# EAGLE schematic FPGA_S7 (EAGLE 9.6.2)

## Sheet 1 of 3: Interface
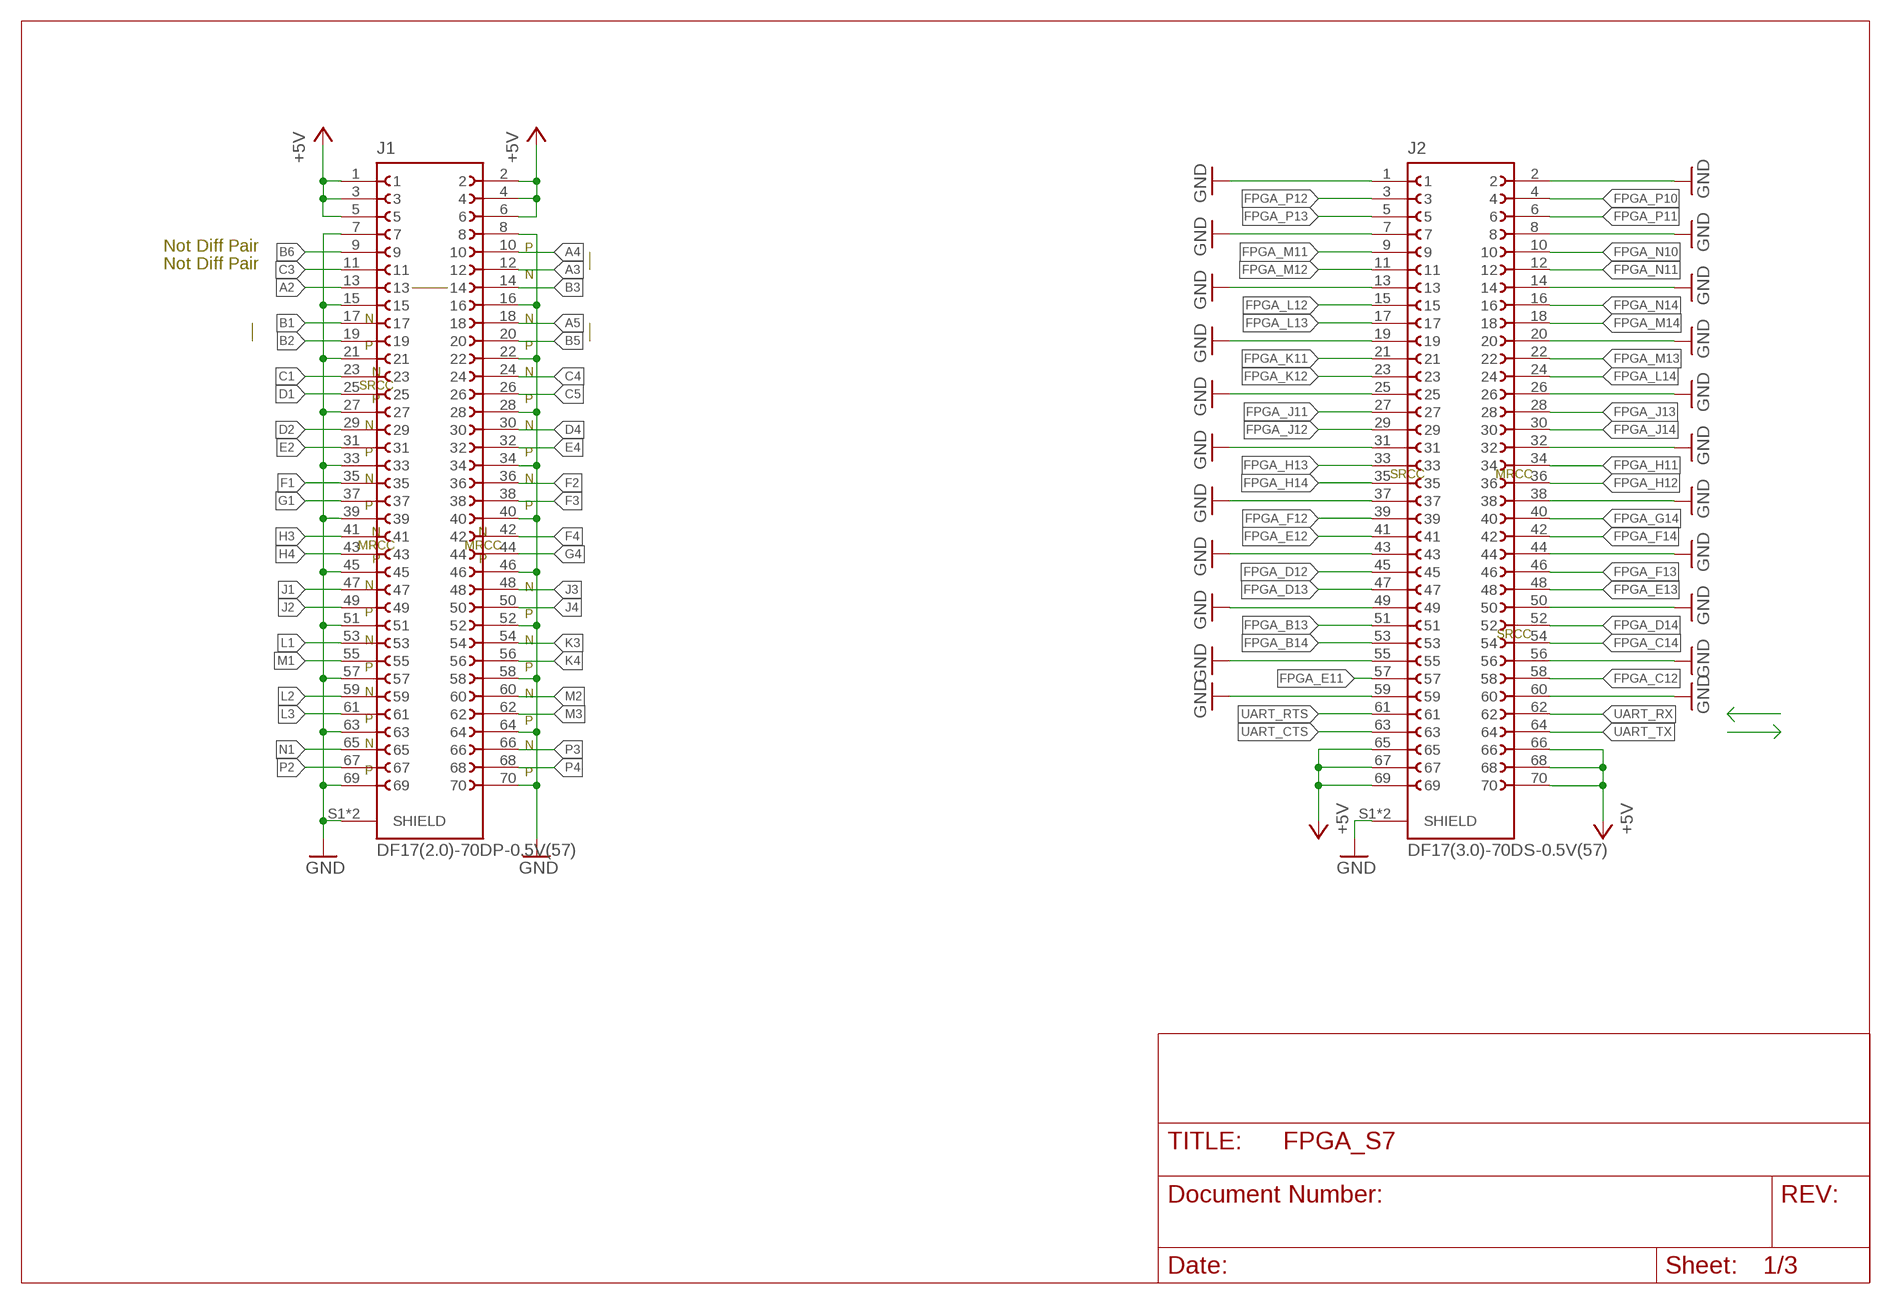
[diagram p0: schematic, sheet 1]

### Parts
J1  DF17(2.0)-70DP-0.5V(57)  [DF17(2.0)-70DP-0.5V(57)]
J2  DF17(3.0)-70DS-0.5V(57)  [DF17(3.0)-70DS-0.5V(57)]

### Nets
+5V: J1.1 J1.2 J1.3 J1.4 J1.5 J1.6 J2.65 J2.66 J2.67 J2.68 J2.69 J2.70 ; also sheet 3
A2 [data]: J1.13 ; also sheet 2
A3 [data]: J1.12 ; also sheet 2
A4 [data]: J1.10 ; also sheet 2
A5 [data]: J1.18 ; also sheet 2
B1 [data]: J1.17 ; also sheet 2
B2 [data]: J1.19 ; also sheet 2
B3 [data]: J1.14 ; also sheet 2
B5 [data]: J1.20 ; also sheet 2
B6 [data]: J1.9 ; also sheet 2
C1 [data]: J1.23 ; also sheet 2
C3 [data]: J1.11 ; also sheet 2
C4 [data]: J1.24 ; also sheet 2
C5 [data]: J1.26 ; also sheet 2
D1 [data]: J1.25 ; also sheet 2
D2 [data]: J1.29 ; also sheet 2
D4 [data]: J1.30 ; also sheet 2
E2 [data]: J1.31 ; also sheet 2
E4 [data]: J1.32 ; also sheet 2
F1 [data]: J1.35 ; also sheet 2
F2 [data]: J1.36 ; also sheet 2
F3 [data]: J1.38 ; also sheet 2
F4 [data]: J1.42 ; also sheet 2
FPGA_B13 [data]: J2.51 ; also sheet 2
FPGA_B14 [data]: J2.53 ; also sheet 2
FPGA_C12 [data]: J2.58 ; also sheet 2
FPGA_C14 [data]: J2.54 ; also sheet 2
FPGA_D12 [data]: J2.45 ; also sheet 2
FPGA_D13 [data]: J2.47 ; also sheet 2
FPGA_D14 [data]: J2.52 ; also sheet 2
FPGA_E11: J2.57 ; also sheet 2
FPGA_E12 [data]: J2.41 ; also sheet 2
FPGA_E13 [data]: J2.48 ; also sheet 2
FPGA_F12 [data]: J2.39 ; also sheet 2
FPGA_F13 [data]: J2.46 ; also sheet 2
FPGA_F14 [data]: J2.42 ; also sheet 2
FPGA_G14 [data]: J2.40 ; also sheet 2
FPGA_H11 [data]: J2.34 ; also sheet 2
FPGA_H12 [data]: J2.36 ; also sheet 2
FPGA_H13 [data]: J2.33 ; also sheet 2
FPGA_H14 [data]: J2.35 ; also sheet 2
FPGA_J11 [data]: J2.27 ; also sheet 2
FPGA_J12 [data]: J2.29 ; also sheet 2
FPGA_J13 [data]: J2.28 ; also sheet 2
FPGA_J14 [data]: J2.30 ; also sheet 2
FPGA_K11 [data]: J2.21 ; also sheet 2
FPGA_K12 [data]: J2.23 ; also sheet 2
FPGA_L12 [data]: J2.15 ; also sheet 2
FPGA_L13 [data]: J2.17 ; also sheet 2
FPGA_L14 [data]: J2.24 ; also sheet 2
FPGA_M11 [data]: J2.9 ; also sheet 2
FPGA_M12 [data]: J2.11 ; also sheet 2
FPGA_M13 [data]: J2.22 ; also sheet 2
FPGA_M14 [data]: J2.18 ; also sheet 2
FPGA_N10 [data]: J2.10 ; also sheet 2
FPGA_N11 [data]: J2.12 ; also sheet 2
FPGA_N14 [data]: J2.16 ; also sheet 2
FPGA_P10 [data]: J2.4 ; also sheet 2
FPGA_P11 [data]: J2.6 ; also sheet 2
FPGA_P12 [data]: J2.3 ; also sheet 2
FPGA_P13 [data]: J2.5 ; also sheet 2
G1 [data]: J1.37 ; also sheet 2
G4 [data]: J1.44 ; also sheet 2
GND: J1.7 J1.8 J1.15 J1.16 J1.21 J1.22 J1.27 J1.28 J1.33 J1.34 J1.39 J1.40 J1.45 J1.46 J1.51 J1.52 J1.57 J1.58 J1.63 J1.64 J1.69 J1.70 J1.S1(SHIELD) J1.S2(SHIELD) J2.1 J2.2 J2.7 J2.8 J2.13 J2.14 J2.19 J2.20 J2.25 J2.26 J2.31 J2.32 J2.37 J2.38 J2.43 J2.44 J2.49 J2.50 J2.55 J2.56 J2.59 J2.60 J2.S1(SHIELD) J2.S2(SHIELD) ; also sheet 2,3
H3 [data]: J1.41 ; also sheet 2
H4 [data]: J1.43 ; also sheet 2
J1 [data]: J1.47 ; also sheet 2
J2 [data]: J1.49 ; also sheet 2
J3 [data]: J1.48 ; also sheet 2
J4 [data]: J1.50 ; also sheet 2
K3 [data]: J1.54 ; also sheet 2
K4 [data]: J1.56 ; also sheet 2
L1 [data]: J1.53 ; also sheet 2
L2 [data]: J1.59 ; also sheet 2
L3 [data]: J1.61 ; also sheet 2
M1 [data]: J1.55 ; also sheet 2
M2 [data]: J1.60 ; also sheet 2
M3 [data]: J1.62 ; also sheet 2
N1 [data]: J1.65 ; also sheet 2
P2 [data]: J1.67 ; also sheet 2
P3 [data]: J1.66 ; also sheet 2
P4 [data]: J1.68 ; also sheet 2
UART_CTS [data]: J2.63 ; also sheet 2
UART_RTS [data]: J2.61 ; also sheet 2
UART_RX [data]: J2.62 ; also sheet 2
UART_TX [data]: J2.64 ; also sheet 2

### Notes on the sheet
- Not Diff Pair
- P
   
  N
- Not Diff Pair
- N
   
  P
- N
   
  P
- N
  SRCC
  P
- N
   
  P
- N
   
  P
- N
   
  P
- SRCC | MRCC
- N
   
  P
- N
   
  P
- N
  MRCC
  P
- N
  MRCC
  P
- N
   
  P
- N
   
  P
- SRCC
- N
   
  P
- N
   
  P
- N
   
  P
- N
   
  P
- N
   
  P
- N
   
  P

## Sheet 2 of 3: FPGA
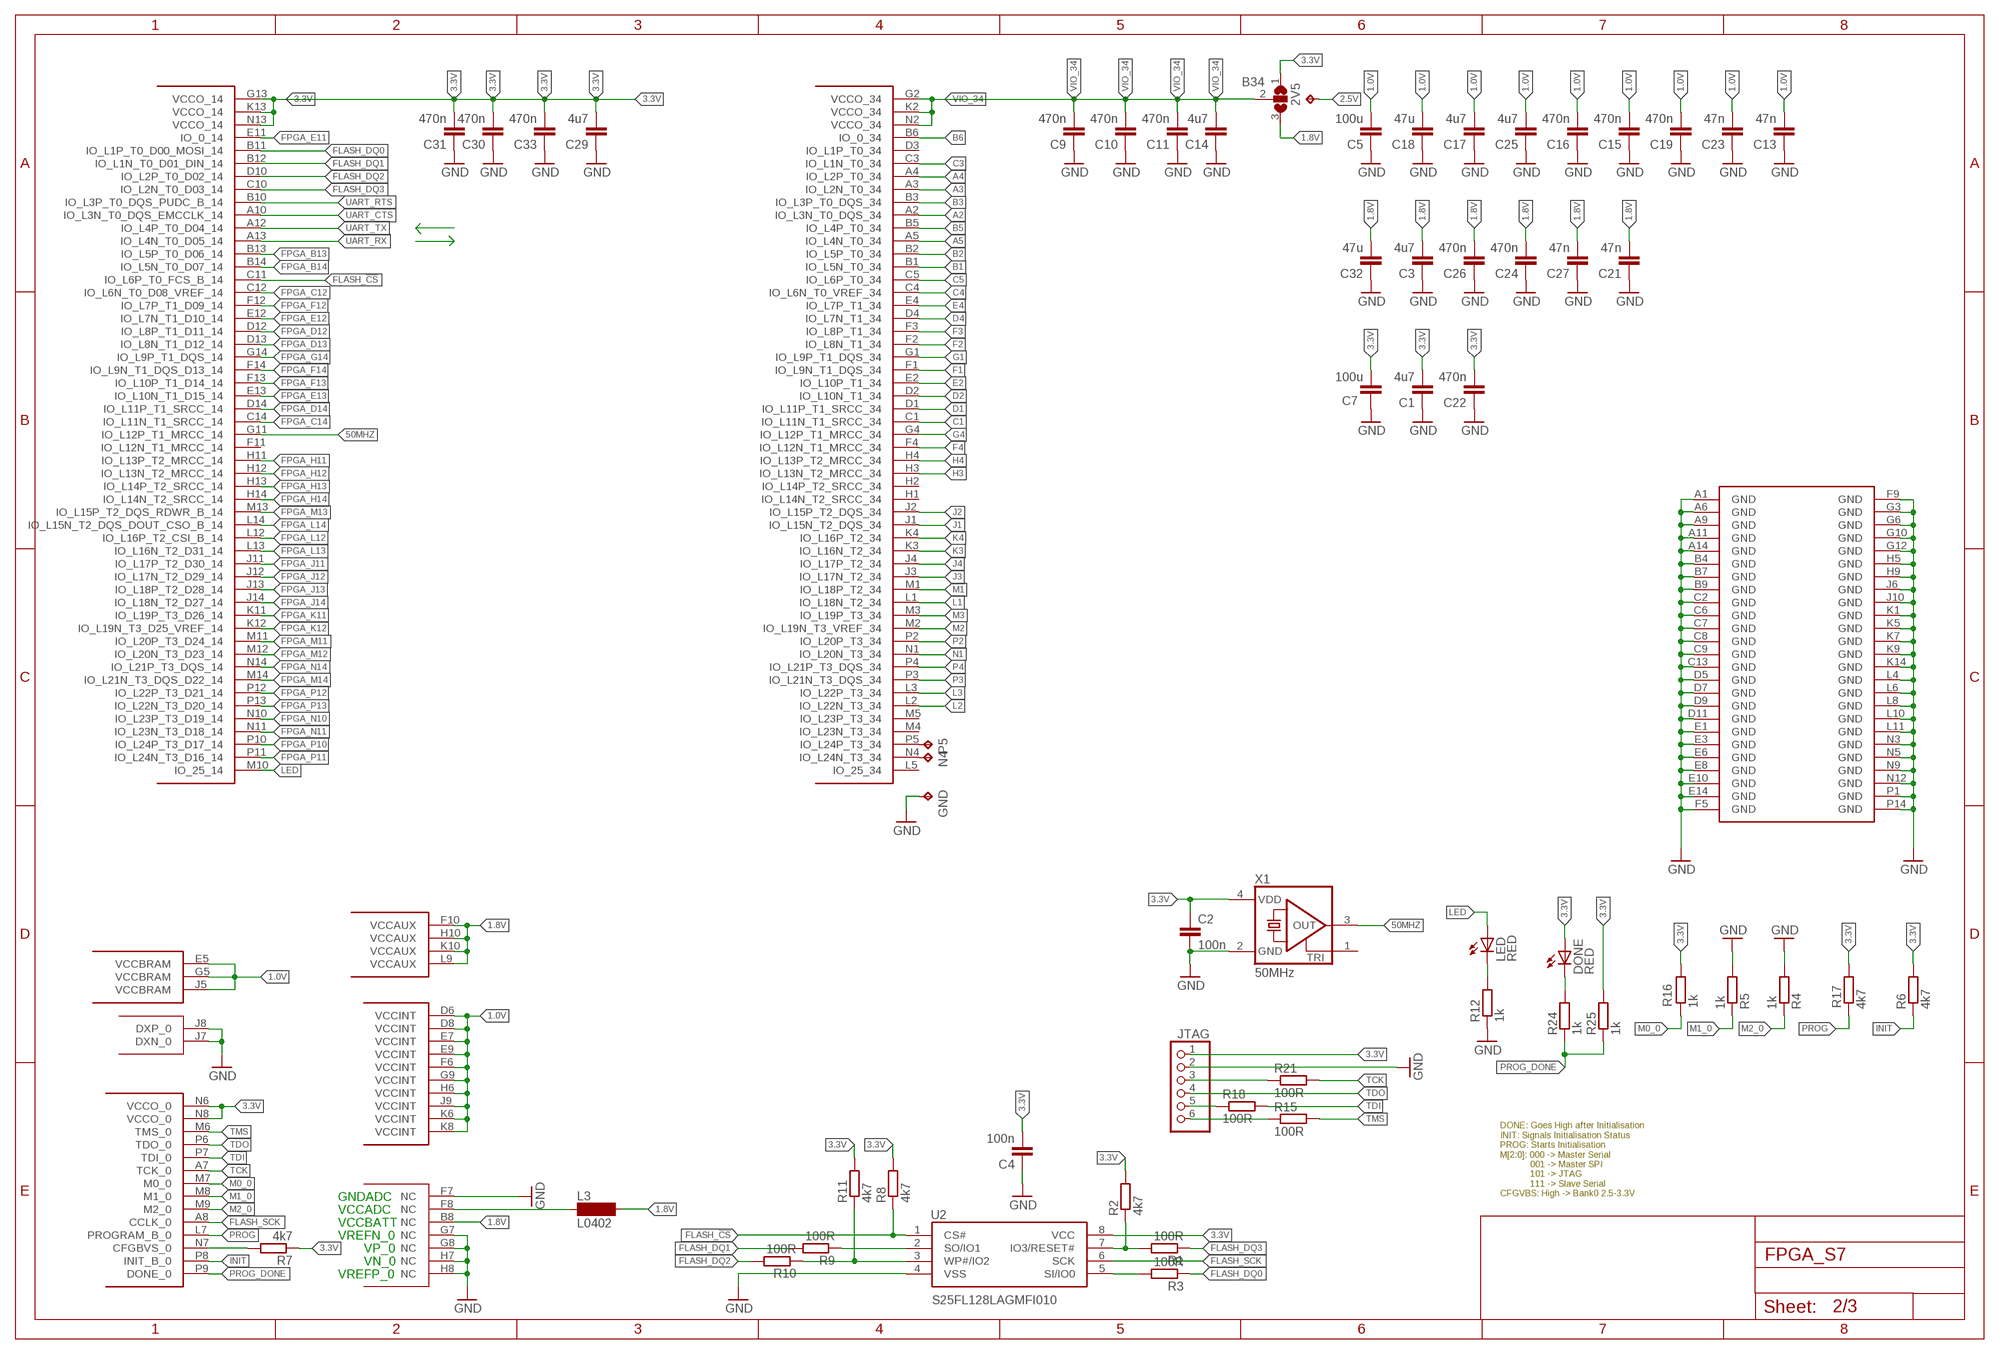
[diagram p1: schematic, sheet 2]

### Parts
2V5  TPTP12SQ  [TP12SQ]
B34  SJ2W  [SJ_2]
C1  4u7  C-EUC0603  [C0603]
C2  100n  C-EUC0402  [C0402]
C3  4u7  C-EUC0603  [C0603]
C4  100n  C-EUC0402  [C0402]
C5  100u  C-EUC1206  [C1206]
C7  100u  C-EUC1206  [C1206]
C9  470n  C-EUC0402  [C0402]
C10  470n  C-EUC0402  [C0402]
C11  470n  C-EUC0402  [C0402]
C13  47n  C-EUC0402  [C0402]
C14  4u7  C-EUC0603  [C0603]
C15  470n  C-EUC0402  [C0402]
C16  470n  C-EUC0402  [C0402]
C17  4u7  C-EUC0603  [C0603]
C18  47u  C-EUC0805  [C0805]
C19  470n  C-EUC0402  [C0402]
C21  47n  C-EUC0402  [C0402]
C22  470n  C-EUC0402  [C0402]
C23  47n  C-EUC0402  [C0402]
C24  470n  C-EUC0402  [C0402]
C25  4u7  C-EUC0603  [C0603]
C26  470n  C-EUC0402  [C0402]
C27  47n  C-EUC0402  [C0402]
C29  4u7  C-EUC0603  [C0603]
C30  470n  C-EUC0402  [C0402]
C31  470n  C-EUC0402  [C0402]
C32  47u  C-EUC0805  [C0805]
C33  470n  C-EUC0402  [C0402]
DONE  RED  LEDCHIP-LED0603  [CHIP-LED0603]
GND  TPTP15R  [TP15R]
JTAG  PINHD-1X6_2.00  [1X06M]
L3  L0402  [C0402]
LED  RED  LEDCHIP-LED0603  [CHIP-LED0603]
N4  TPTP15R  [TP15R]
P5  TPTP15R  [TP15R]
R1  100R  R-EU_R0402  [R0402]
R2  4k7  R-EU_R0402  [R0402]
R3  100R  R-EU_R0402  [R0402]
R4  1k  R-EU_R0402  [R0402]
R5  1k  R-EU_R0402  [R0402]
R6  4k7  R-EU_R0402  [R0402]
R7  4k7  R-EU_R0402  [R0402]
R8  4k7  R-EU_R0402  [R0402]
R9  100R  R-EU_R0402  [R0402]
R10  100R  R-EU_R0402  [R0402]
R11  4k7  R-EU_R0402  [R0402]
R12  1k  R-EU_R0402  [R0402]
R15  100R  R-EU_R0402  [R0402]
R16  1k  R-EU_R0402  [R0402]
R17  4k7  R-EU_R0402  [R0402]
R18  100R  R-EU_R0402  [R0402]
R21  100R  R-EU_R0402  [R0402]
R24  1k  R-EU_R0402  [R0402]
R25  1k  R-EU_R0402  [R0402]
U1  XC7S15-2FTGB196I  [BGA196C100P14X14_1500X1500X155]
U2  S25FL128LAGMFI010  [SOIC127P800X216-8N]
X1  50MHz  ASE  [ASE]

### Nets
1.0V: C5.1 C13.2 C15.2 C16.2 C17.2 C18.1 C19.2 C23.2 C25.2 U1.D6(VCCINT) U1.D8(VCCINT) U1.E5(VCCBRAM) U1.E7(VCCINT) U1.E9(VCCINT) U1.F6(VCCINT) U1.G5(VCCBRAM) U1.G9(VCCINT) U1.H6(VCCINT) U1.J5(VCCBRAM) U1.J9(VCCINT) U1.K6(VCCINT) U1.K8(VCCINT) ; also sheet 3
1.8V: B34.3 C3.2 C21.2 C24.2 C26.2 C27.2 C32.2 L3.2 U1.B8(NC) U1.F10(VCCAUX) U1.H10(VCCAUX) U1.K10(VCCAUX) U1.L9(VCCAUX) ; also sheet 3
2.5V: 2V5.TP ; also sheet 3
3.3V: B34.1 C1.2 C2.1 C4.2 C7.1 C22.2 C29.2 C30.2 C31.2 C33.2 DONE.A JTAG.1 R2.2 R6.2 R7.1 R8.2 R11.2 R16.1 R17.1 R25.2 U1.G13(VCCO_14) U1.K13(VCCO_14) U1.N6(VCCO_0) U1.N8(VCCO_0) U1.N13(VCCO_14) U2.8(VCC) X1.4(VDD) ; also sheet 3
50MHZ: U1.G11(IO_L12P_T1_MRCC_14) X1.3(OUT)
A2 [data]: U1.A2(IO_L3N_T0_DQS_34) ; also sheet 1
A3 [data]: U1.A3(IO_L2N_T0_34) ; also sheet 1
A4 [data]: U1.A4(IO_L2P_T0_34) ; also sheet 1
A5 [data]: U1.A5(IO_L4N_T0_34) ; also sheet 1
B1 [data]: U1.B1(IO_L5N_T0_34) ; also sheet 1
B2 [data]: U1.B2(IO_L5P_T0_34) ; also sheet 1
B3 [data]: U1.B3(IO_L3P_T0_DQS_34) ; also sheet 1
B5 [data]: U1.B5(IO_L4P_T0_34) ; also sheet 1
B6 [data]: U1.B6(IO_0_34) ; also sheet 1
C1 [data]: U1.C1(IO_L11N_T1_SRCC_34) ; also sheet 1
C3 [data]: U1.C3(IO_L1N_T0_34) ; also sheet 1
C4 [data]: U1.C4(IO_L6N_T0_VREF_34) ; also sheet 1
C5 [data]: U1.C5(IO_L6P_T0_34) ; also sheet 1
D1 [data]: U1.D1(IO_L11P_T1_SRCC_34) ; also sheet 1
D2 [data]: U1.D2(IO_L10N_T1_34) ; also sheet 1
D4 [data]: U1.D4(IO_L7N_T1_34) ; also sheet 1
E2 [data]: U1.E2(IO_L10P_T1_34) ; also sheet 1
E4 [data]: U1.E4(IO_L7P_T1_34) ; also sheet 1
F1 [data]: U1.F1(IO_L9N_T1_DQS_34) ; also sheet 1
F2 [data]: U1.F2(IO_L8N_T1_34) ; also sheet 1
F3 [data]: U1.F3(IO_L8P_T1_34) ; also sheet 1
F4 [data]: U1.F4(IO_L12N_T1_MRCC_34) ; also sheet 1
FLASH_!CS: R8.1 U1.C11(IO_L6P_T0_FCS_B_14) U2.1(CS#)
FLASH_DQ0: R3.1 U1.B11(IO_L1P_T0_D00_MOSI_14)
FLASH_DQ1: R9.2 U1.B12(IO_L1N_T0_D01_DIN_14)
FLASH_DQ2: R10.2 U1.D10(IO_L2P_T0_D02_14)
FLASH_DQ3: R1.1 U1.C10(IO_L2N_T0_D03_14)
FLASH_SCK: U1.A8(CCLK_0) U2.6(SCK)
FPGA_B13 [data]: U1.B13(IO_L5P_T0_D06_14) ; also sheet 1
FPGA_B14 [data]: U1.B14(IO_L5N_T0_D07_14) ; also sheet 1
FPGA_C12 [data]: U1.C12(IO_L6N_T0_D08_VREF_14) ; also sheet 1
FPGA_C14 [data]: U1.C14(IO_L11N_T1_SRCC_14) ; also sheet 1
FPGA_D12 [data]: U1.D12(IO_L8P_T1_D11_14) ; also sheet 1
FPGA_D13 [data]: U1.D13(IO_L8N_T1_D12_14) ; also sheet 1
FPGA_D14 [data]: U1.D14(IO_L11P_T1_SRCC_14) ; also sheet 1
FPGA_E11: U1.E11(IO_0_14) ; also sheet 1
FPGA_E12 [data]: U1.E12(IO_L7N_T1_D10_14) ; also sheet 1
FPGA_E13 [data]: U1.E13(IO_L10N_T1_D15_14) ; also sheet 1
FPGA_F12 [data]: U1.F12(IO_L7P_T1_D09_14) ; also sheet 1
FPGA_F13 [data]: U1.F13(IO_L10P_T1_D14_14) ; also sheet 1
FPGA_F14 [data]: U1.F14(IO_L9N_T1_DQS_D13_14) ; also sheet 1
FPGA_G14 [data]: U1.G14(IO_L9P_T1_DQS_14) ; also sheet 1
FPGA_H11 [data]: U1.H11(IO_L13P_T2_MRCC_14) ; also sheet 1
FPGA_H12 [data]: U1.H12(IO_L13N_T2_MRCC_14) ; also sheet 1
FPGA_H13 [data]: U1.H13(IO_L14P_T2_SRCC_14) ; also sheet 1
FPGA_H14 [data]: U1.H14(IO_L14N_T2_SRCC_14) ; also sheet 1
FPGA_J11 [data]: U1.J11(IO_L17P_T2_D30_14) ; also sheet 1
FPGA_J12 [data]: U1.J12(IO_L17N_T2_D29_14) ; also sheet 1
FPGA_J13 [data]: U1.J13(IO_L18P_T2_D28_14) ; also sheet 1
FPGA_J14 [data]: U1.J14(IO_L18N_T2_D27_14) ; also sheet 1
FPGA_K11 [data]: U1.K11(IO_L19P_T3_D26_14) ; also sheet 1
FPGA_K12 [data]: U1.K12(IO_L19N_T3_D25_VREF_14) ; also sheet 1
FPGA_L12 [data]: U1.L12(IO_L16P_T2_CSI_B_14) ; also sheet 1
FPGA_L13 [data]: U1.L13(IO_L16N_T2_D31_14) ; also sheet 1
FPGA_L14 [data]: U1.L14(IO_L15N_T2_DQS_DOUT_CSO_B_14) ; also sheet 1
FPGA_M11 [data]: U1.M11(IO_L20P_T3_D24_14) ; also sheet 1
FPGA_M12 [data]: U1.M12(IO_L20N_T3_D23_14) ; also sheet 1
FPGA_M13 [data]: U1.M13(IO_L15P_T2_DQS_RDWR_B_14) ; also sheet 1
FPGA_M14 [data]: U1.M14(IO_L21N_T3_DQS_D22_14) ; also sheet 1
FPGA_N10 [data]: U1.N10(IO_L23P_T3_D19_14) ; also sheet 1
FPGA_N11 [data]: U1.N11(IO_L23N_T3_D18_14) ; also sheet 1
FPGA_N14 [data]: U1.N14(IO_L21P_T3_DQS_14) ; also sheet 1
FPGA_P10 [data]: U1.P10(IO_L24P_T3_D17_14) ; also sheet 1
FPGA_P11 [data]: U1.P11(IO_L24N_T3_D16_14) ; also sheet 1
FPGA_P12 [data]: U1.P12(IO_L22P_T3_D21_14) ; also sheet 1
FPGA_P13 [data]: U1.P13(IO_L22N_T3_D20_14) ; also sheet 1
G1 [data]: U1.G1(IO_L9P_T1_DQS_34) ; also sheet 1
G4 [data]: U1.G4(IO_L12P_T1_MRCC_34) ; also sheet 1
GND: C1.1 C2.2 C3.1 C4.1 C5.2 C7.2 C9.1 C10.1 C11.1 C13.1 C14.1 C15.1 C16.1 C17.1 C18.2 C19.1 C21.1 C22.1 C23.1 C24.1 C25.1 C26.1 C27.1 C29.1 C30.1 C31.1 C32.1 C33.1 GND.TP JTAG.2 R4.2 R5.2 R12.1 U1.A1(GND) U1.A6(GND) U1.A9(GND) U1.A11(GND) U1.A14(GND) U1.B4(GND) U1.B7(GND) U1.B9(GND) U1.C2(GND) U1.C6(GND) U1.C7(GND) U1.C8(GND) U1.C9(GND) U1.C13(GND) U1.D5(GND) U1.D7(GND) U1.D9(GND) U1.D11(GND) U1.E1(GND) U1.E3(GND) U1.E6(GND) U1.E8(GND) U1.E10(GND) U1.E14(GND) U1.F5(GND) U1.F7(NC) U1.F9(GND) U1.G3(GND) U1.G6(GND) U1.G7(NC) U1.G8(NC) U1.G10(GND) U1.G12(GND) U1.H5(GND) U1.H7(NC) U1.H8(NC) U1.H9(GND) U1.J6(GND) U1.J7(DXN_0) U1.J8(DXP_0) U1.J10(GND) U1.K1(GND) U1.K5(GND) U1.K7(GND) U1.K9(GND) U1.K14(GND) U1.L4(GND) U1.L6(GND) U1.L8(GND) U1.L10(GND) U1.L11(GND) U1.N3(GND) U1.N5(GND) U1.N9(GND) U1.N12(GND) U1.P1(GND) U1.P14(GND) U2.4(VSS) X1.2(GND) ; also sheet 1,3
H3 [data]: U1.H3(IO_L13N_T2_MRCC_34) ; also sheet 1
H4 [data]: U1.H4(IO_L13P_T2_MRCC_34) ; also sheet 1
INIT: R6.1 U1.P8(INIT_B_0)
J1 [data]: U1.J1(IO_L15N_T2_DQS_34) ; also sheet 1
J2 [data]: U1.J2(IO_L15P_T2_DQS_34) ; also sheet 1
J3 [data]: U1.J3(IO_L17N_T2_34) ; also sheet 1
J4 [data]: U1.J4(IO_L17P_T2_34) ; also sheet 1
K3 [data]: U1.K3(IO_L16N_T2_34) ; also sheet 1
K4 [data]: U1.K4(IO_L16P_T2_34) ; also sheet 1
L1 [data]: U1.L1(IO_L18N_T2_34) ; also sheet 1
L2 [data]: U1.L2(IO_L22N_T3_34) ; also sheet 1
L3 [data]: U1.L3(IO_L22P_T3_34) ; also sheet 1
LED: LED.A U1.M10(IO_25_14)
M0_0: R16.2 U1.M7(M0_0)
M1 [data]: U1.M1(IO_L18P_T2_34) ; also sheet 1
M1_0: R5.1 U1.M8(M1_0)
M2 [data]: U1.M2(IO_L19N_T3_VREF_34) ; also sheet 1
M2_0: R4.1 U1.M9(M2_0)
M3 [data]: U1.M3(IO_L19P_T3_34) ; also sheet 1
N1 [data]: U1.N1(IO_L20N_T3_34) ; also sheet 1
N$00003: L3.1 U1.F8(NC)
N$00004: LED.C R12.2
N$00006: R1.2 R2.1 U2.7(IO3/RESET#)
N$00009: R7.2 U1.N7(CFGBVS_0)
N$00010: R3.2 U2.5(SI/IO0)
N$00011: R9.1 U2.2(SO/IO1)
N$00012: R10.1 R11.1 U2.3(WP#/IO2)
N$00013: P5.TP U1.P5(IO_L24P_T3_34)
N$00014: N4.TP U1.N4(IO_L24N_T3_34)
N$00019: DONE.C R24.2
N$00022: JTAG.5 R18.1
N$00027: JTAG.3 R21.1
N$00031: JTAG.6 R15.1
P2 [data]: U1.P2(IO_L20P_T3_34) ; also sheet 1
P3 [data]: U1.P3(IO_L21N_T3_DQS_34) ; also sheet 1
P4 [data]: U1.P4(IO_L21P_T3_DQS_34) ; also sheet 1
PROG: R17.2 U1.L7(PROGRAM_B_0)
PROG_DONE: R24.1 R25.1 U1.P9(DONE_0)
TCK: R21.2 U1.A7(TCK_0)
TDI: R18.2 U1.P7(TDI_0)
TDO: JTAG.4 U1.P6(TDO_0)
TMS: R15.2 U1.M6(TMS_0)
UART_CTS [data]: U1.A10(IO_L3N_T0_DQS_EMCCLK_14) ; also sheet 1
UART_RTS [data]: U1.B10(IO_L3P_T0_DQS_PUDC_B_14) ; also sheet 1
UART_RX [data]: U1.A13(IO_L4N_T0_D05_14) ; also sheet 1
UART_TX [data]: U1.A12(IO_L4P_T0_D04_14) ; also sheet 1
VIO_34: B34.2 C9.2 C10.2 C11.2 C14.2 U1.G2(VCCO_34) U1.K2(VCCO_34) U1.N2(VCCO_34)
Unconnected: U1.D3(IO_L1P_T0_34) U1.F11(IO_L12N_T1_MRCC_14) U1.H1(IO_L14N_T2_SRCC_34) U1.H2(IO_L14P_T2_SRCC_34) U1.L5(IO_25_34) U1.M4(IO_L23N_T3_34) U1.M5(IO_L23P_T3_34) X1.1(TRI)

### Notes on the sheet
- GNDADC
- DONE: Goes High after Initialisation
  INIT: Signals Initialisation Status
  PROG: Starts Initialisation
  M[2:0]: 000 -> Master Serial
              001 -> Master SPI
              101 -> JTAG
              111 -> Slave Serial
  CFGVBS: High -> Bank0 2.5-3.3V
- VCCADC
- VCCBATT
- VREFN_0
- VP_0
- VN_0
- VREFP_0

## Sheet 3 of 3: Power
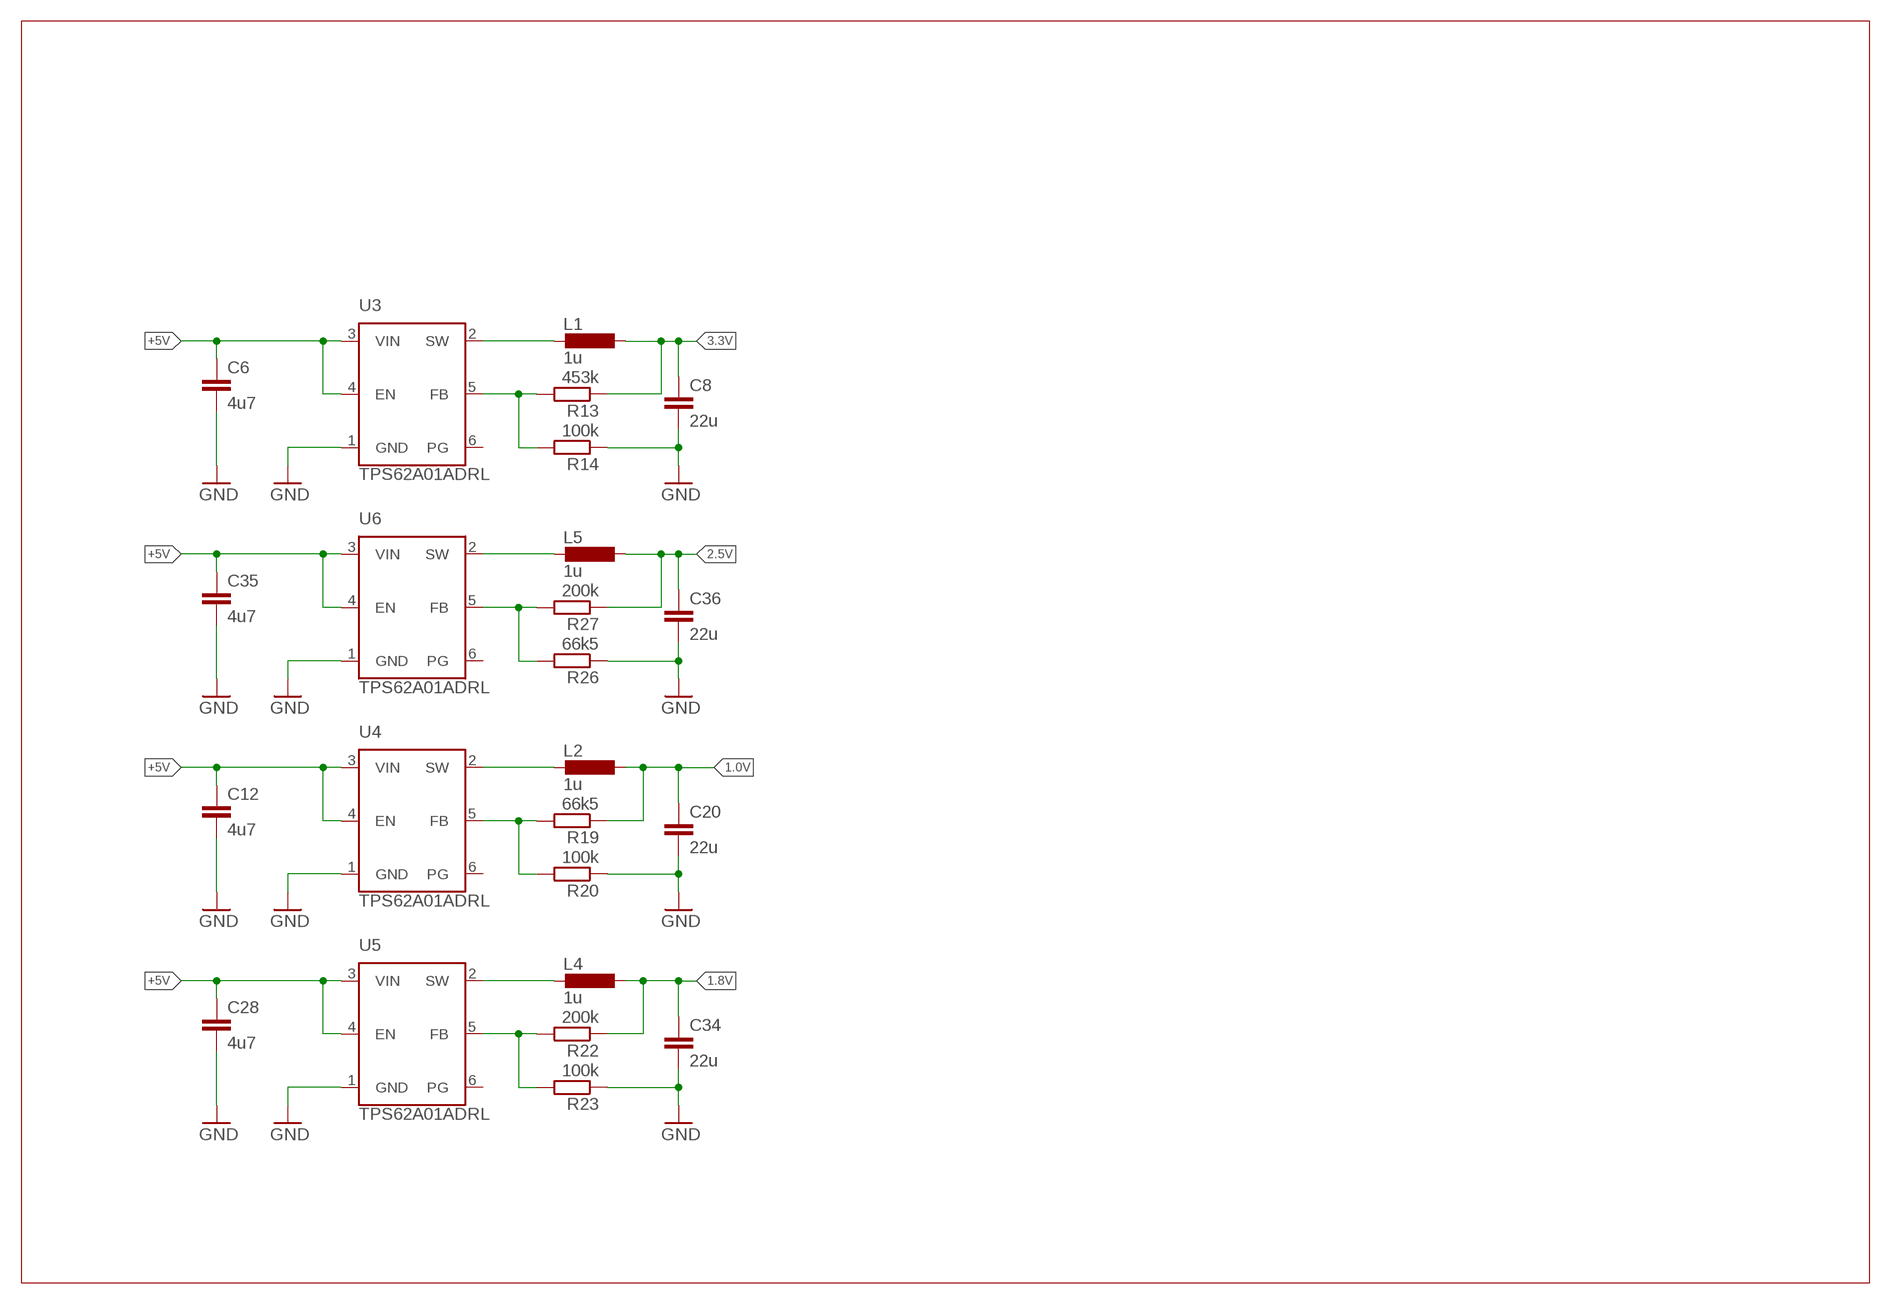
[diagram p2: schematic, sheet 3]

### Parts
C6  4u7  C-EUC0603  [C0603]
C8  22u  C-EUC0603  [C0603]
C12  4u7  C-EUC0603  [C0603]
C20  22u  C-EUC0603  [C0603]
C28  4u7  C-EUC0603  [C0603]
C34  22u  C-EUC0603  [C0603]
C35  4u7  C-EUC0603  [C0603]
C36  22u  C-EUC0603  [C0603]
L1  1u  L-EU1008  [L1008]
L2  1u  L-EU1008  [L1008]
L4  1u  L-EU1008  [L1008]
L5  1u  L-EU1008  [L1008]
R13  453k  R-EU_R0402  [R0402]
R14  100k  R-EU_R0402  [R0402]
R19  66k5  R-EU_R0402  [R0402]
R20  100k  R-EU_R0402  [R0402]
R22  200k  R-EU_R0402  [R0402]
R23  100k  R-EU_R0402  [R0402]
R26  66k5  R-EU_R0402  [R0402]
R27  200k  R-EU_R0402  [R0402]
U3  TPS62A01ADRL  [SOTFL50P160X60-6N]
U4  TPS62A01ADRL  [SOTFL50P160X60-6N]
U5  TPS62A01ADRL  [SOTFL50P160X60-6N]
U6  TPS62A01ADRL  [SOTFL50P160X60-6N]

### Nets
1.0V: C20.1 L2.1 R19.1 ; also sheet 2
1.8V: C34.1 L4.1 R22.1 ; also sheet 2
2.5V: C36.1 L5.1 R27.1 ; also sheet 2
3.3V: C8.1 L1.1 R13.1 ; also sheet 2
+5V: C6.1 C12.1 C28.1 C35.1 U3.3(VIN) U3.4(EN) U4.3(VIN) U4.4(EN) U5.3(VIN) U5.4(EN) U6.3(VIN) U6.4(EN) ; also sheet 1
GND: C6.2 C8.2 C12.2 C20.2 C28.2 C34.2 C35.2 C36.2 R14.1 R20.1 R23.1 R26.1 U3.1(GND) U4.1(GND) U5.1(GND) U6.1(GND) ; also sheet 1,2
N$00005: L2.2 U4.2(SW)
N$00020: L5.2 U6.2(SW)
N$00021: R26.2 R27.2 U6.5(FB)
N$00040: R19.2 R20.2 U4.5(FB)
N$00044: R13.2 R14.2 U3.5(FB)
N$00045: L4.2 U5.2(SW)
N$00049: R22.2 R23.2 U5.5(FB)
N$50: L1.2 U3.2(SW)
Unconnected: U3.6(PG) U4.6(PG) U5.6(PG) U6.6(PG)

## Library data of the parts
2V5 GND N4 P5 = testpad:TP: Test pad
B34 = jumper:SJ2W: SMD solder JUMPER
C1 C3 C6 C12 C14 C17 C25 C28 C29 C35 = rcl:C-EU: CAPACITOR, European symbol; LCSC: C19666
C2 C4 = rcl:C-EU: CAPACITOR, European symbol; LCSC: C1525
C5 C7 = rcl:C-EU: CAPACITOR, European symbol; DIGIKEY: 490-GRM31CD80J107MEA8LCT-ND; LCSC: C15008; SPICEPREFIX: C
C8 C20 C34 C36 = rcl:C-EU: CAPACITOR, European symbol; LCSC: C109448
C9-C11 C15 C16 C19 C22 C24 C26 C30 C31 C33 = rcl:C-EU: CAPACITOR, European symbol; LCSC: C162159
C13 C21 C23 C27 = rcl:C-EU: CAPACITOR, European symbol; LCSC: C327054
C18 = rcl:C-EU: CAPACITOR, European symbol; LCSC: C77072; SPICEPREFIX: C
C32 = rcl:C-EU: CAPACITOR, European symbol; LCSC: C77072
DONE LED = led:LED: LED OSRAM: - CHIPLED LG R971, LG N971, LY N971, LG Q971, LY Q971, LO R971, LY R971 LH N974, LH R974 LS Q976, LO Q976, LY Q976 LO Q996 - Hyper CHIPLED LW Q18S LB Q993, LB Q99A, LB R99A - SideLED LS A670, LO A670, LY A670, LG A670, LP A670 LB A673, LV A673, LT A673, LW A673 LH A674 LY A675 LS A676, LA A676, LO A676, LY A676, LW A676 LS A679, LY A679, LG A679 - Hyper Micro SIDELED® LS Y876, LA Y876, LO Y876, LY Y876 LT Y87S - SmartLED LW L88C, LW L88S LB L89C, LB L89S, LG L890 LS L89K, LO L89K, LY L89K LS L896, LA L896, LO L896, LY L896 - TOPLED LS T670, LO T670, LY T670, LG T670, LP T670 LSG T670, LSP T670, LSY T670, LOP T670, LYG T670 LG T671, LOG T671, LSG T671 LB T673, LV T673, LT T673, LW T673 LH T674 LS T676, LA T676, LO T676, LY T676, LB T676, LH T676, LSB T676, LW T676 LB T67C, LV T67C, LT T67C, LS T67K, LO T67K, LY T67K, LW E67C LS E67B, LA E67B, LO E67B, LY E67B, LB E67C, LV E67C, LT E67C LW T67C LS T679, LY T679, LG T679 LS T770, LO T770, LY T770, LG T770, LP T770 LB T773, LV T773, LT T773, LW T773 LH T774 LS E675, LA E675, LY E675, LS T675 LS T776, LA T776, LO T776, LY T776, LB T776 LHGB T686 LT T68C, LB T68C - Hyper Mini TOPLED® LB M676 - Mini TOPLED Santana® LG M470 LS M47K, LO M47K, LY M47K Source: http://www.osram.convergy.de LUXEON: - LUMILED® LXK2-PW12-R00, LXK2-PW12-S00, LXK2-PW14-U00, LXK2-PW14-V00 LXK2-PM12-R00, LXK2-PM12-S00, LXK2-PM14-U00 LXK2-PE12-Q00, LXK2-PE12-R00, LXK2-PE12-S00, LXK2-PE14-T00, LXK2-PE14-U00 LXK2-PB12-K00, LXK2-PB12-L00, LXK2-PB12-M00, LXK2-PB14-N00, LXK2-PB14-P00, LXK2-PB14-Q00 LXK2-PR12-L00, LXK2-PR12-M00, LXK2-PR14-Q00, LXK2-PR14-R00 LXK2-PD12-Q00, LXK2-PD12-R00, LXK2-PD12-S00 LXK2-PH12-R00, LXK2-PH12-S00 LXK2-PL12-P00, LXK2-PL12-Q00, LXK2-PL12-R00 Source: www.luxeon.com KINGBRIGHT: KA-3528ASYC Source: www.kingbright.com; LCSC: C7493803
J1 = Hirose:DF17(2.0)-70DP-0.5V(57); DIGIKEY: H11133CT-ND; LCSC: C597892
J2 = Hirose:DF17(3.0)-70DS-0.5V(57); DIGIKEY: H11112CT-ND; LCSC: C3644992
JTAG = pinhead:PINHD-1X6: PIN HEADER
L1 L2 L4 L5 = rcl:L-EU: INDUCTOR, European symbol; DIGIKEY: 490-5112-1-ND; LCSC: C86091; MPN: LQM2HPN1R0MG0L
L3 = misc:L; LCSC: C88970
R1 R3 R9 R10 R15 R18 R21 = rcl:R-EU_: RESISTOR, European symbol; LCSC: C25076
R2 R6-R8 R11 R17 = rcl:R-EU_: RESISTOR, European symbol; LCSC: C25900
R4 = rcl:R-EU_: RESISTOR, European symbol; LCSC: C106235
R5 R12 R16 R24 R25 = rcl:R-EU_: RESISTOR, European symbol; LCSC: C11702
R13 R27 = rcl:R-EU_: RESISTOR, European symbol; LCSC: C137978; SPICEPREFIX: R
R14 R26 = rcl:R-EU_: RESISTOR, European symbol; DIGIKEY: RMCF0402FT100KCT-ND; LCSC: C60491; SPICEPREFIX: R
R19 = rcl:R-EU_: RESISTOR, European symbol; DIGIKEY: RMCF0402FT66K5CT-ND; LCSC: C2998095; SPICEPREFIX: R
R20 R23 = rcl:R-EU_: RESISTOR, European symbol; LCSC: C60491; SPICEPREFIX: R
R22 = rcl:R-EU_: RESISTOR, European symbol; LCSC: C114763; SPICEPREFIX: R
U1 = XC7S15-2FTGB196I:XC7S15-2FTGB196I: XILINX - XC7S15-2FTGB196I - FPGA, Spartan-7, 2000 Blocks, 12800 Macrocells, 360Kbit RAM, 950mV to 1.05V Core Supply, CSBGA-196 Source: Datasheet <https://www.xilinx.com/support/documentation/data_sheets/ds189-spartan-7-data-sheet.pdf>; DESCRIPTION: XILINX - XC7S15-2FTGB196I - FPGA, Spartan-7, 2000 Blocks, 12800 Macrocells, 360Kbit RAM, 950mV to 1.05V Core Supply, CSBGA-196; DIGIKEY: 122-2233-ND; HEIGHT: 1.55mm; LCSC: C1521909; MANUFACTURER_NAME: XILINX; MANUFACTURER_PART_NUMBER: XC7S15-2FTGB196I; MOUSER: 217-XC7S15-2FTGB196I; PREIS: 28,63
U2 = S25FL128LAGMFI010:S25FL128LAGMFI010: CYPRESS SEMICONDUCTOR - S25FL128LAGMFI010 - FLASH MEMORY, 128MBIT, 133MHZ, SOIC-8 Source: Datasheet <http://www.cypress.com/file/316171/download>; DESCRIPTION: CYPRESS SEMICONDUCTOR - S25FL128LAGMFI010 - FLASH MEMORY, 128MBIT, 133MHZ, SOIC-8; DIGIKEY: 448-S25FL128LAGMFI010-ND; FARNELL: 2771137; HEIGHT: 2.16mm; LCSC: C2959152; MANUFACTURER_NAME: Cypress Semiconductor; MANUFACTURER_PART_NUMBER: S25FL128LAGMFI010; MOUSER_PART_NUMBER: 727-S25FL128LAGMFI01; MOUSER_PRICE-STOCK: https://www.mouser.co.uk/ProductDetail/Cypress-Semiconductor/S25FL128LAGMFI010?qs=5aG0NVq1C4xPU5M9VGd2Vg%3D%3D; MPN: S25FL128LAGMFI010
U3-U6 = TPS62A01DRLR:TPS62A01ADRL; DESCRIPTION: 2.5V-5.5V input, 1-A high efficiency step-down converter in 2x2 QFN or SOT563 package; DIGIKEY: 296-TPS62A01ADRLRCT-ND; HEIGHT: 0.6mm; LCSC: C5181455; MANUFACTURER_NAME: Texas Instruments; MANUFACTURER_PART_NUMBER: TPS62A01ADRLR; MOUSER: 595-TPS62A01ADRLR
X1 = crystal:ASE: 3.3Vdc CMOS SMD CRYSTAL CLOCK OSCILLATOR SOurce: www.abracon.com; FARNELL: 2467898; LCSC: C596955; MBM: 1; MPN_: ASE-50.000MHZ-E-T; OC_FARNELL: unknown; OC_NEWARK: unknown; PREIS: 1,54

## Net classes
0 default: width 0.14 mm, drill 0.3 mm